# Altium schematic sheet USB_Breakout.SchDoc
size A4
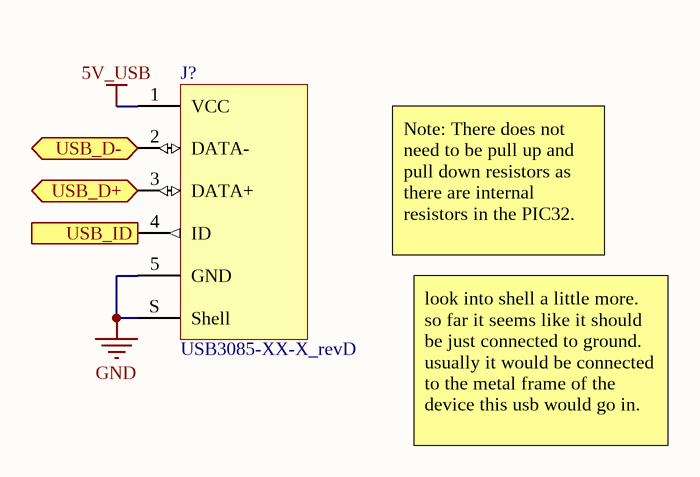
[diagram p0: USB_Breakout.SchDoc]

## Parts
J?  USB3085-XX-X_revD  [USB3085-XX-X_revD]

## Ports
USB_D+ (bidir), USB_D- (bidir), USB_ID (out)

## Nets
5V_USB: J?.1(VCC)
GND: J?.5(GND) J?.S(Shell)
USB_D+: J?.3(DATA+) ; port USB_D+
USB_D-: J?.2(DATA-) ; port USB_D-
USB_ID: J?.4(ID) ; port USB_ID

## Notes on the sheet
- Note: There does not need to be pull up and pull down resistors as there are internal resistors in the PIC32.
- look into shell a little more. so far it seems like it should be just connected to ground. usually it would be connected to the metal frame of the device this usb would go in.

## Library data of the parts
J? = USB3085-XX-X_revD: Micro USB Receptacle, Type AB, SMT, Horizontal, Bottom Mount, without Peg